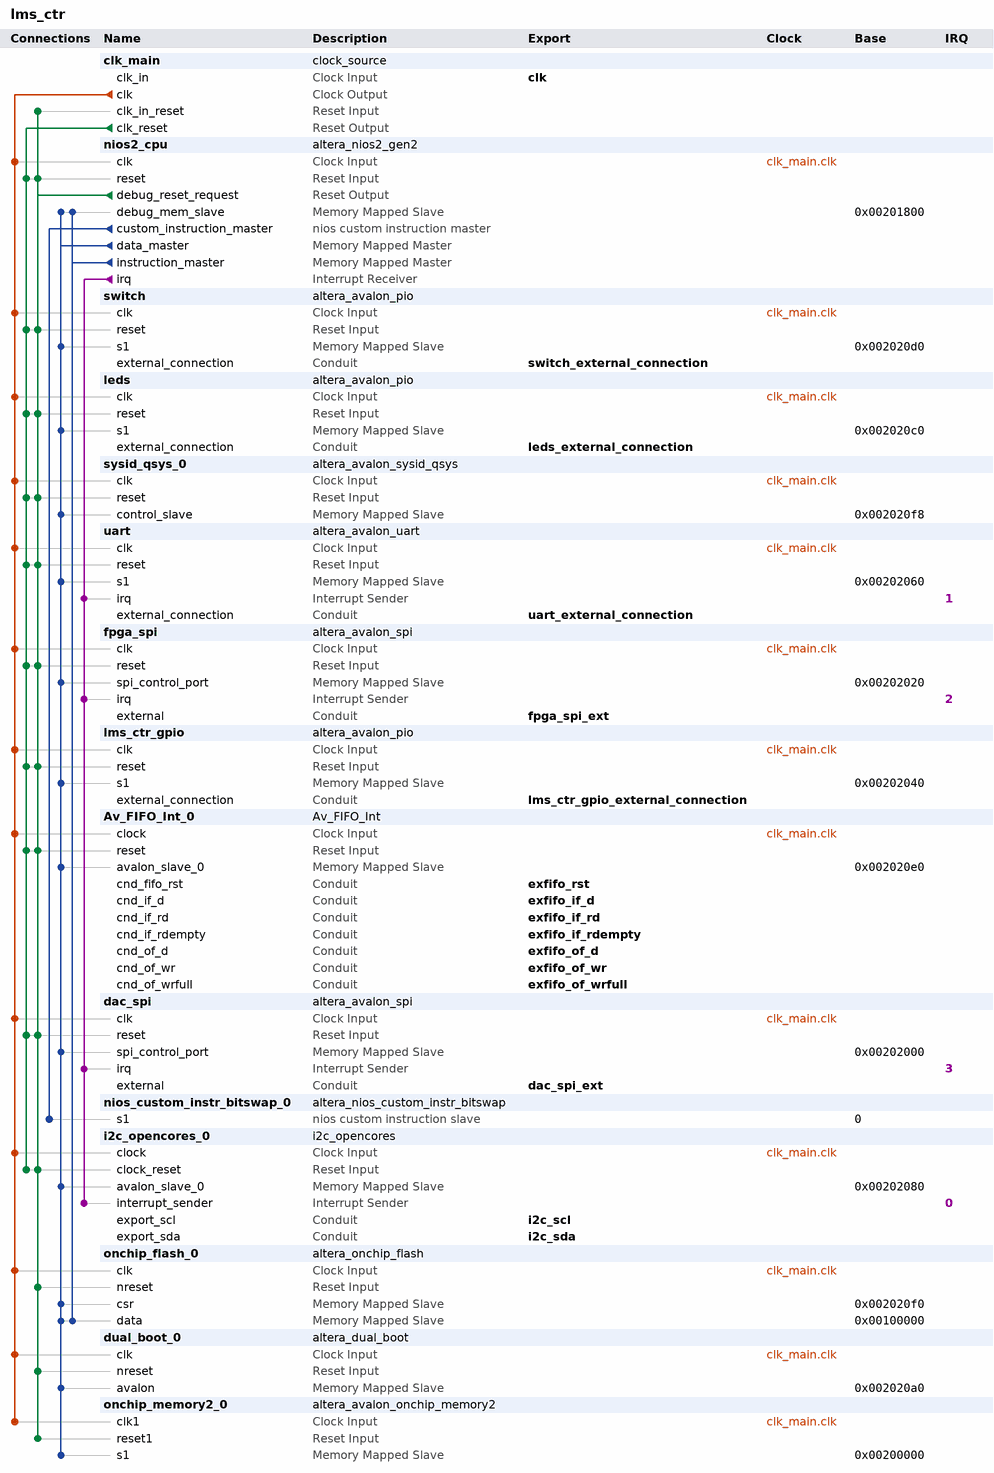
[diagram p0: system contents]
# Platform Designer (Qsys) system lms_ctr, MAX 10 10M16SAU169C8G
# Parameters at their usual value, and those the tool derives, are not listed.
package require -exact qsys 15.1
create_system lms_ctr
set_project_property DEVICE_FAMILY {MAX 10}
set_project_property DEVICE 10M16SAU169C8G

add_instance clk_main clock_source 15.1
set_instance_parameter_value clk_main clockFrequency 52000000

add_instance nios2_cpu altera_nios2_gen2 15.1
set_instance_parameter_value nios2_cpu dcache_size 2048
set_instance_parameter_value nios2_cpu exceptionSlave onchip_flash_0.data
set_instance_parameter_value nios2_cpu icache_size 4096
set_instance_parameter_value nios2_cpu impl Tiny
set_instance_parameter_value nios2_cpu resetSlave onchip_flash_0.data

add_instance switch altera_avalon_pio 15.1
set_instance_parameter_value switch direction Input
set_instance_parameter_value switch width 8

add_instance leds altera_avalon_pio 15.1
set_instance_parameter_value leds direction Output
set_instance_parameter_value leds width 8

add_instance sysid_qsys_0 altera_avalon_sysid_qsys 15.1
set_instance_parameter_value sysid_qsys_0 id 4920

add_instance uart altera_avalon_uart 15.1
set_instance_parameter_value uart baud 115200
set_instance_parameter_value uart dataBits 8
set_instance_parameter_value uart fixedBaud true
set_instance_parameter_value uart parity NONE
set_instance_parameter_value uart stopBits 1

add_instance fpga_spi altera_avalon_spi 15.1
set_instance_parameter_value fpga_spi clockPolarity 0
set_instance_parameter_value fpga_spi dataWidth 8
set_instance_parameter_value fpga_spi insertDelayBetweenSlaveSelectAndSClk true
set_instance_parameter_value fpga_spi masterSPI true
set_instance_parameter_value fpga_spi numberOfSlaves 2
set_instance_parameter_value fpga_spi targetClockRate 20000000
set_instance_parameter_value fpga_spi targetSlaveSelectToSClkDelay 200.0

add_instance lms_ctr_gpio altera_avalon_pio 15.1
set_instance_parameter_value lms_ctr_gpio bitModifyingOutReg true
set_instance_parameter_value lms_ctr_gpio direction Output
set_instance_parameter_value lms_ctr_gpio resetValue 3
set_instance_parameter_value lms_ctr_gpio width 4

add_instance Av_FIFO_Int_0 Av_FIFO_Int 1.0
set_instance_parameter_value Av_FIFO_Int_0 width 32

add_instance dac_spi altera_avalon_spi 15.1
set_instance_parameter_value dac_spi clockPhase 1
set_instance_parameter_value dac_spi clockPolarity 0
set_instance_parameter_value dac_spi dataWidth 8
set_instance_parameter_value dac_spi masterSPI true
set_instance_parameter_value dac_spi numberOfSlaves 1
set_instance_parameter_value dac_spi targetClockRate 20000000

add_instance nios_custom_instr_bitswap_0 altera_nios_custom_instr_bitswap 15.1

add_instance i2c_opencores_0 i2c_opencores 13.0

add_instance onchip_flash_0 altera_onchip_flash 15.1.1
set_instance_parameter_value onchip_flash_0 CLOCK_FREQUENCY 30.72
set_instance_parameter_value onchip_flash_0 CONFIGURATION_MODE {Dual Compressed Images}
set_instance_parameter_value onchip_flash_0 SECTOR_ACCESS_MODE {Read only,Read and write,Read and write,Read and write,Read and write}
set_instance_parameter_value onchip_flash_0 initFlashContent true
set_instance_parameter_value onchip_flash_0 initializationFileName altera_onchip_flash.hex
set_instance_parameter_value onchip_flash_0 useNonDefaultInitFile false

add_instance dual_boot_0 altera_dual_boot 15.1
set_instance_parameter_value dual_boot_0 CLOCK_FREQUENCY 30.72

add_instance onchip_memory2_0 altera_avalon_onchip_memory2 15.1
set_instance_parameter_value onchip_memory2_0 dataWidth 32
set_instance_parameter_value onchip_memory2_0 dualPort false
set_instance_parameter_value onchip_memory2_0 initMemContent false
set_instance_parameter_value onchip_memory2_0 initializationFileName onchip_mem.hex
set_instance_parameter_value onchip_memory2_0 memorySize 4096

# connections
add_connection clk_main.clk Av_FIFO_Int_0.clock clock
add_connection clk_main.clk dac_spi.clk clock
add_connection clk_main.clk dual_boot_0.clk clock
add_connection clk_main.clk fpga_spi.clk clock
add_connection clk_main.clk i2c_opencores_0.clock clock
add_connection clk_main.clk leds.clk clock
add_connection clk_main.clk lms_ctr_gpio.clk clock
add_connection clk_main.clk nios2_cpu.clk clock
add_connection clk_main.clk onchip_flash_0.clk clock
add_connection clk_main.clk onchip_memory2_0.clk1 clock
add_connection clk_main.clk switch.clk clock
add_connection clk_main.clk sysid_qsys_0.clk clock
add_connection clk_main.clk uart.clk clock
add_connection clk_main.clk_reset Av_FIFO_Int_0.reset reset
add_connection clk_main.clk_reset dac_spi.reset reset
add_connection clk_main.clk_reset fpga_spi.reset reset
add_connection clk_main.clk_reset i2c_opencores_0.clock_reset reset
add_connection clk_main.clk_reset leds.reset reset
add_connection clk_main.clk_reset lms_ctr_gpio.reset reset
add_connection clk_main.clk_reset nios2_cpu.reset reset
add_connection clk_main.clk_reset switch.reset reset
add_connection clk_main.clk_reset sysid_qsys_0.reset reset
add_connection clk_main.clk_reset uart.reset reset
add_connection nios2_cpu.debug_reset_request Av_FIFO_Int_0.reset reset
add_connection nios2_cpu.debug_reset_request clk_main.clk_in_reset reset
add_connection nios2_cpu.debug_reset_request dac_spi.reset reset
add_connection nios2_cpu.debug_reset_request dual_boot_0.nreset reset
add_connection nios2_cpu.debug_reset_request fpga_spi.reset reset
add_connection nios2_cpu.debug_reset_request i2c_opencores_0.clock_reset reset
add_connection nios2_cpu.debug_reset_request leds.reset reset
add_connection nios2_cpu.debug_reset_request lms_ctr_gpio.reset reset
add_connection nios2_cpu.debug_reset_request nios2_cpu.reset reset
add_connection nios2_cpu.debug_reset_request onchip_flash_0.nreset reset
add_connection nios2_cpu.debug_reset_request onchip_memory2_0.reset1 reset
add_connection nios2_cpu.debug_reset_request switch.reset reset
add_connection nios2_cpu.debug_reset_request sysid_qsys_0.reset reset
add_connection nios2_cpu.debug_reset_request uart.reset reset
add_connection nios2_cpu.data_master Av_FIFO_Int_0.avalon_slave_0 avalon
set_connection_parameter_value nios2_cpu.data_master/Av_FIFO_Int_0.avalon_slave_0 baseAddress 0x002020e0
add_connection nios2_cpu.data_master dac_spi.spi_control_port avalon
set_connection_parameter_value nios2_cpu.data_master/dac_spi.spi_control_port baseAddress 0x00202000
add_connection nios2_cpu.data_master dual_boot_0.avalon avalon
set_connection_parameter_value nios2_cpu.data_master/dual_boot_0.avalon baseAddress 0x002020a0
add_connection nios2_cpu.data_master fpga_spi.spi_control_port avalon
set_connection_parameter_value nios2_cpu.data_master/fpga_spi.spi_control_port baseAddress 0x00202020
add_connection nios2_cpu.data_master i2c_opencores_0.avalon_slave_0 avalon
set_connection_parameter_value nios2_cpu.data_master/i2c_opencores_0.avalon_slave_0 baseAddress 0x00202080
add_connection nios2_cpu.data_master leds.s1 avalon
set_connection_parameter_value nios2_cpu.data_master/leds.s1 baseAddress 0x002020c0
add_connection nios2_cpu.data_master lms_ctr_gpio.s1 avalon
set_connection_parameter_value nios2_cpu.data_master/lms_ctr_gpio.s1 baseAddress 0x00202040
add_connection nios2_cpu.data_master nios2_cpu.debug_mem_slave avalon
set_connection_parameter_value nios2_cpu.data_master/nios2_cpu.debug_mem_slave baseAddress 0x00201800
add_connection nios2_cpu.data_master onchip_flash_0.csr avalon
set_connection_parameter_value nios2_cpu.data_master/onchip_flash_0.csr baseAddress 0x002020f0
add_connection nios2_cpu.data_master onchip_flash_0.data avalon
set_connection_parameter_value nios2_cpu.data_master/onchip_flash_0.data baseAddress 0x00100000
add_connection nios2_cpu.data_master onchip_memory2_0.s1 avalon
set_connection_parameter_value nios2_cpu.data_master/onchip_memory2_0.s1 baseAddress 0x00200000
add_connection nios2_cpu.data_master switch.s1 avalon
set_connection_parameter_value nios2_cpu.data_master/switch.s1 baseAddress 0x002020d0
add_connection nios2_cpu.data_master sysid_qsys_0.control_slave avalon
set_connection_parameter_value nios2_cpu.data_master/sysid_qsys_0.control_slave baseAddress 0x002020f8
add_connection nios2_cpu.data_master uart.s1 avalon
set_connection_parameter_value nios2_cpu.data_master/uart.s1 baseAddress 0x00202060
add_connection nios2_cpu.instruction_master nios2_cpu.debug_mem_slave avalon
set_connection_parameter_value nios2_cpu.instruction_master/nios2_cpu.debug_mem_slave baseAddress 0x00201800
add_connection nios2_cpu.instruction_master onchip_flash_0.data avalon
set_connection_parameter_value nios2_cpu.instruction_master/onchip_flash_0.data baseAddress 0x00100000
add_connection nios2_cpu.irq dac_spi.irq interrupt
set_connection_parameter_value nios2_cpu.irq/dac_spi.irq irqNumber 3
add_connection nios2_cpu.irq fpga_spi.irq interrupt
set_connection_parameter_value nios2_cpu.irq/fpga_spi.irq irqNumber 2
add_connection nios2_cpu.irq i2c_opencores_0.interrupt_sender interrupt
set_connection_parameter_value nios2_cpu.irq/i2c_opencores_0.interrupt_sender irqNumber 0
add_connection nios2_cpu.irq uart.irq interrupt
set_connection_parameter_value nios2_cpu.irq/uart.irq irqNumber 1
add_connection nios2_cpu.custom_instruction_master nios_custom_instr_bitswap_0.s1 nios_custom_instruction
set_connection_parameter_value nios2_cpu.custom_instruction_master/nios_custom_instr_bitswap_0.s1 CIName nios_custom_instr_bitswap_0
set_connection_parameter_value nios2_cpu.custom_instruction_master/nios_custom_instr_bitswap_0.s1 baseAddress 0

# exported interfaces
add_interface clk clock sink
set_interface_property clk EXPORT_OF clk_main.clk_in
add_interface dac_spi_ext conduit end
set_interface_property dac_spi_ext EXPORT_OF dac_spi.external
add_interface exfifo_if_d conduit end
set_interface_property exfifo_if_d EXPORT_OF Av_FIFO_Int_0.cnd_if_d
add_interface exfifo_if_rd conduit end
set_interface_property exfifo_if_rd EXPORT_OF Av_FIFO_Int_0.cnd_if_rd
add_interface exfifo_if_rdempty conduit end
set_interface_property exfifo_if_rdempty EXPORT_OF Av_FIFO_Int_0.cnd_if_rdempty
add_interface exfifo_of_d conduit end
set_interface_property exfifo_of_d EXPORT_OF Av_FIFO_Int_0.cnd_of_d
add_interface exfifo_of_wr conduit end
set_interface_property exfifo_of_wr EXPORT_OF Av_FIFO_Int_0.cnd_of_wr
add_interface exfifo_of_wrfull conduit end
set_interface_property exfifo_of_wrfull EXPORT_OF Av_FIFO_Int_0.cnd_of_wrfull
add_interface exfifo_rst conduit end
set_interface_property exfifo_rst EXPORT_OF Av_FIFO_Int_0.cnd_fifo_rst
add_interface fpga_spi_ext conduit end
set_interface_property fpga_spi_ext EXPORT_OF fpga_spi.external
add_interface i2c_scl conduit end
set_interface_property i2c_scl EXPORT_OF i2c_opencores_0.export_scl
add_interface i2c_sda conduit end
set_interface_property i2c_sda EXPORT_OF i2c_opencores_0.export_sda
add_interface leds_external_connection conduit end
set_interface_property leds_external_connection EXPORT_OF leds.external_connection
add_interface lms_ctr_gpio_external_connection conduit end
set_interface_property lms_ctr_gpio_external_connection EXPORT_OF lms_ctr_gpio.external_connection
add_interface switch_external_connection conduit end
set_interface_property switch_external_connection EXPORT_OF switch.external_connection
add_interface uart_external_connection conduit end
set_interface_property uart_external_connection EXPORT_OF uart.external_connection

set_interconnect_requirement {$system} qsys_mm.clockCrossingAdapter HANDSHAKE
set_interconnect_requirement {$system} qsys_mm.enableEccProtection FALSE
set_interconnect_requirement {$system} qsys_mm.insertDefaultSlave FALSE
set_interconnect_requirement {$system} qsys_mm.maxAdditionalLatency 1

save_system lms_ctr.qsys
